# Altium project Holberton.PrjPcb (part 1 of 4)
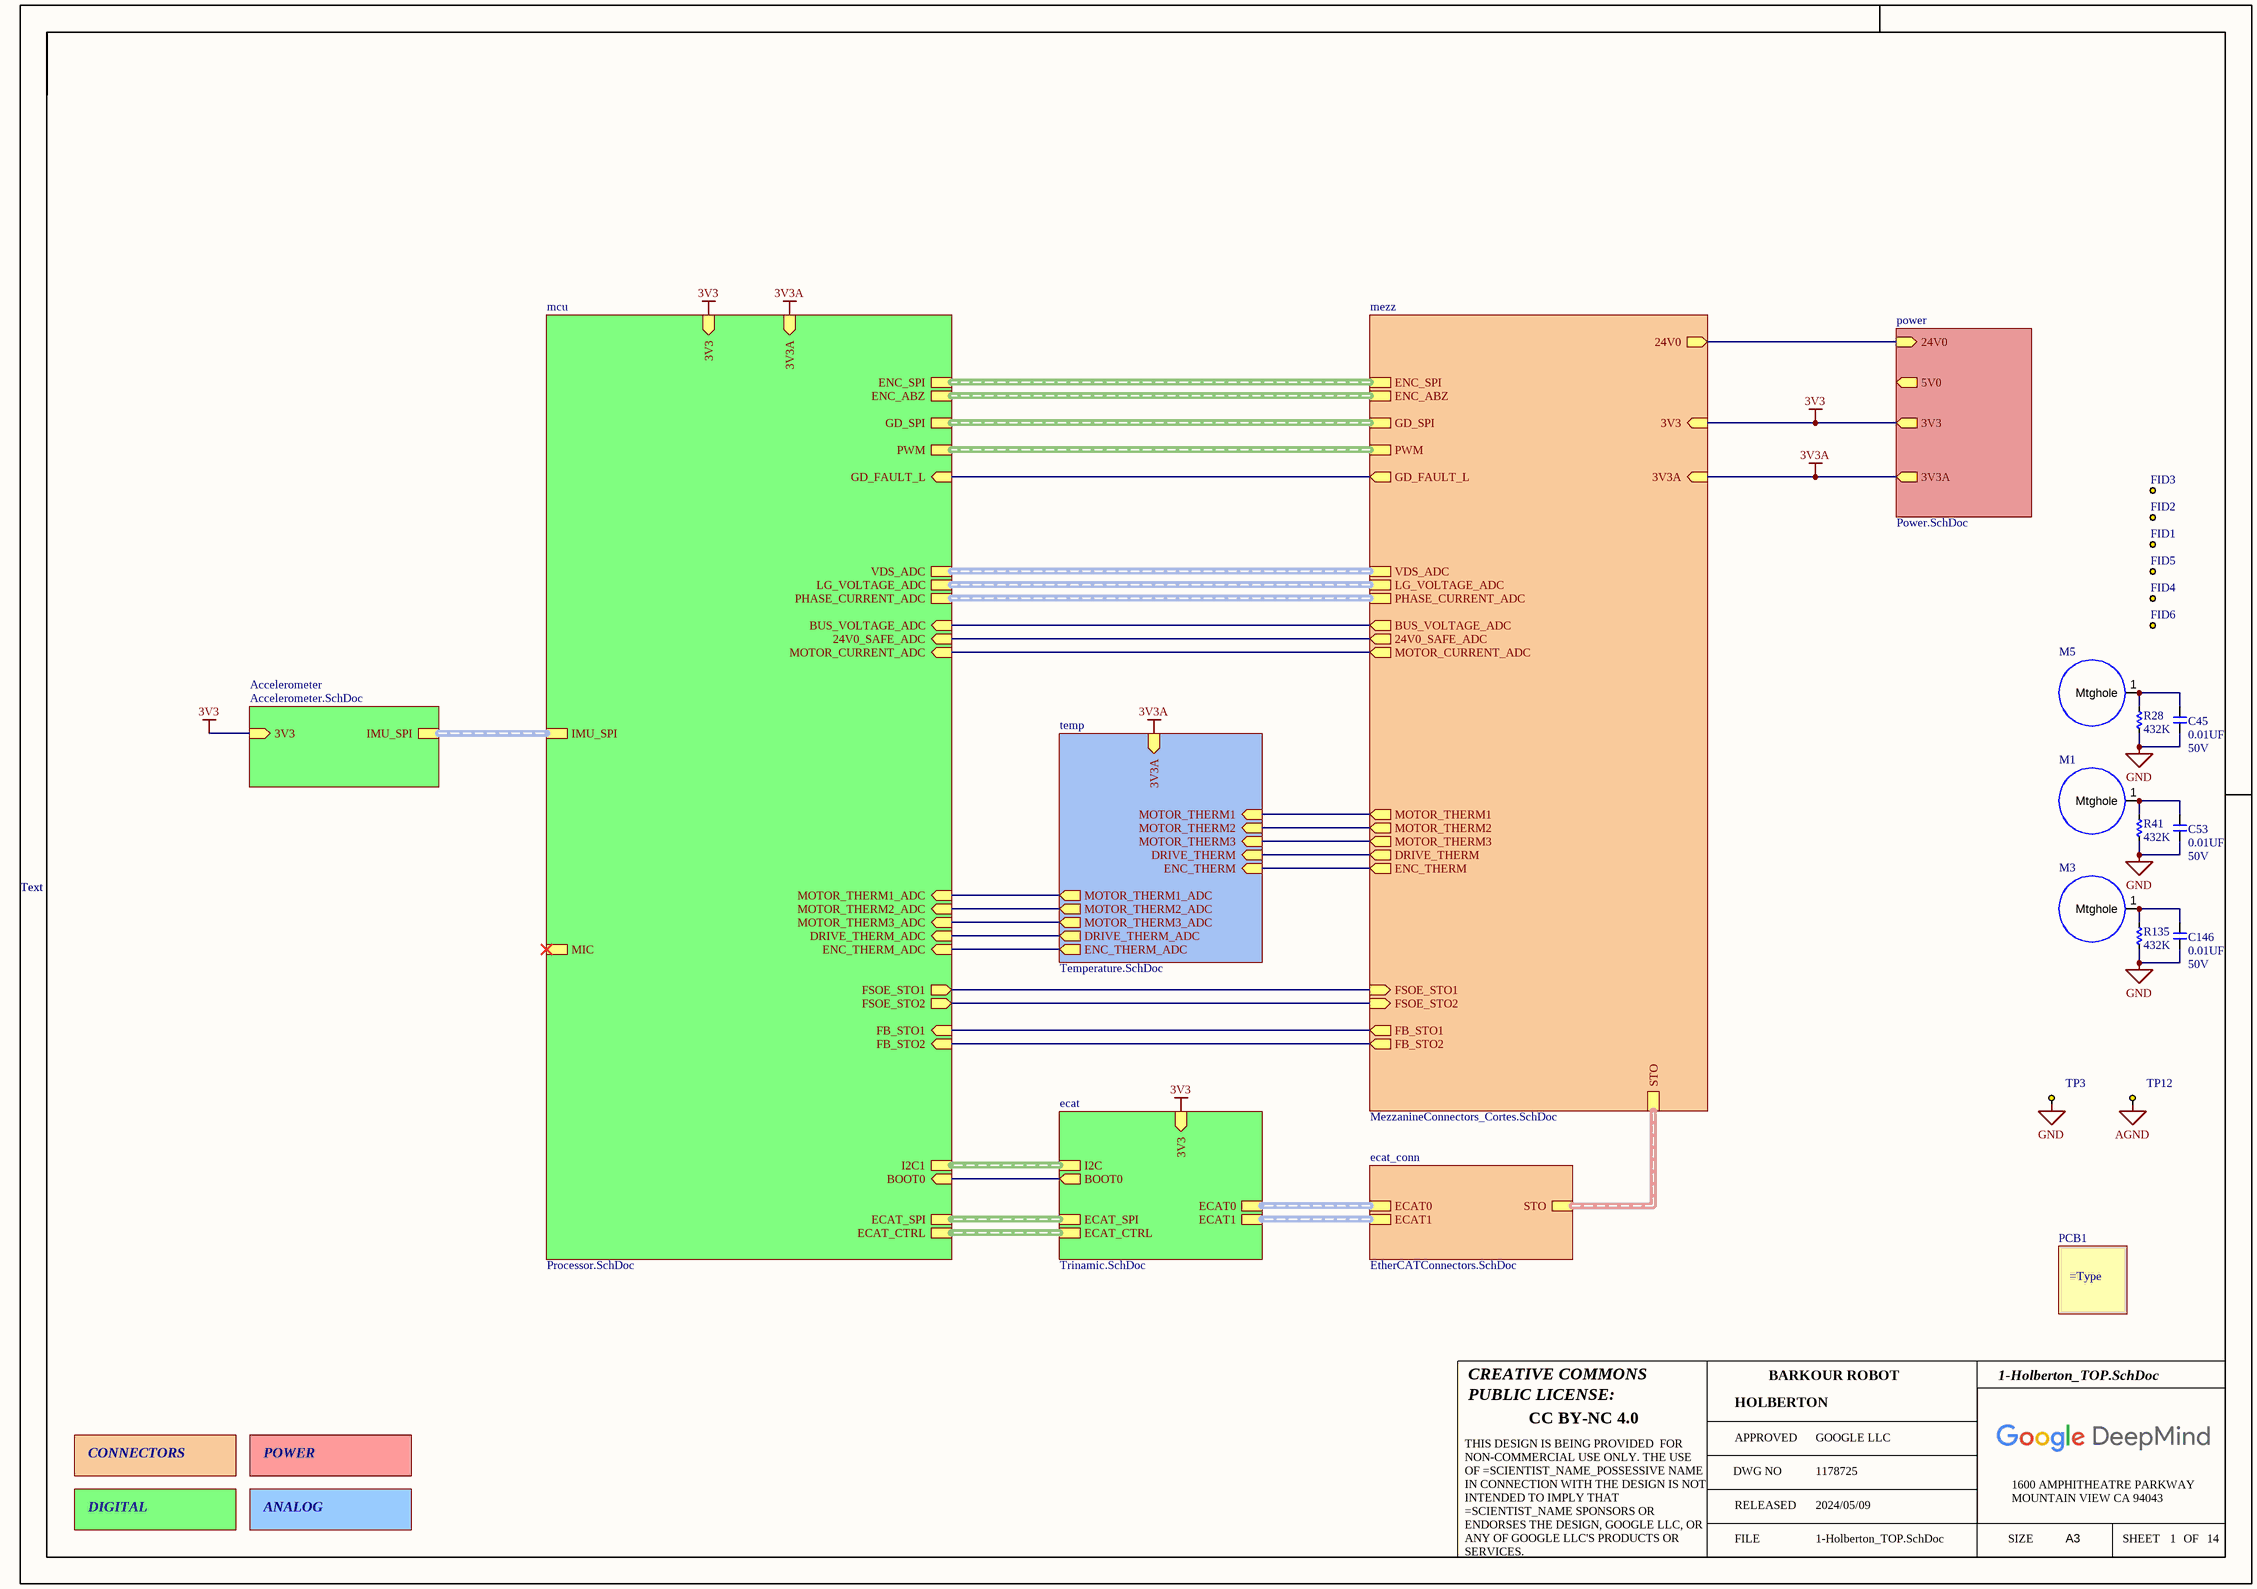
[diagram p0: 1-Holberton_TOP.SchDoc]
GPN_PCBA: 1178725; PROJECT_NAME: HOLBERTON; Scientist_Name: BETTY HOLBERTON; Scientist_Name_Possessive: BETTY HOLBERTON'S
14 sheets, 456 parts. Net scope: hierarchical (ports join the sheet entries above them; power ports are global).
Board file: Holberton.PcbDoc
Sheets:
  1-Holberton_TOP.SchDoc
    mcu = Processor.SchDoc
      proc_support = ProcessorSupport.SchDoc
    Accelerometer = Accelerometer.SchDoc
    ecat = Trinamic.SchDoc
    power = Power.SchDoc
    temp = Temperature.SchDoc
    mezz = MezzanineConnectors_Cortes.SchDoc
      Holberton_Child = 1-Holberton_Child_Top.SchDoc
        feedback = Feedback.SchDoc
        driver = Drive.SchDoc
          PHA = HBridge.SchDoc
          PHB = HBridge.SchDoc
          PHC = HBridge.SchDoc
        sto = STO.SchDoc
    ecat_conn = EtherCATConnectors.SchDoc

## Sheet 1-Holberton_TOP.SchDoc
size 420 x 297 mm; SheetNumber: 1; SheetTotal: 14; PageSetup: Record=PageOptions|CenterHorizontal=True|CenterVertical=True|PrintScale=0.96|XCorrection=1.00|YCorrection=1.00|PrintKind=1|BorderSize=5000000|LeftOffset=0|BottomOffset=0|Orientation=2|PaperLength=4318|PaperWidth=2794|Scale=100|PaperSource=7|PrintQuality=600|MediaType=1|DitherType=10|PaperKind=11" x 17"|PrintScaleMode=1

### Parts
C45  value 0.01UF  Voltage: 50V  [C0402]  (hidden comment: __Template_Cap)
C53  value 0.01UF  Voltage: 50V  [C0402]  (hidden comment: __Template_Cap)
C146  value 0.01UF  Voltage: 50V  [C0402]  (hidden comment: __Template_Cap)
FID1  FIDUCIAL  [FIDUCIAL_1MM]  (value not drawn)  (no BOM)
FID2  FIDUCIAL  [FIDUCIAL_1MM]  (value not drawn)  (no BOM)
FID3  FIDUCIAL  [FIDUCIAL_1MM]  (value not drawn)  (no BOM)
FID4  FIDUCIAL  [FIDUCIAL_1MM]  (value not drawn)  (no BOM)
FID5  FIDUCIAL  [FIDUCIAL_1MM]  (value not drawn)  (no BOM)
FID6  FIDUCIAL  [FIDUCIAL_1MM]  (value not drawn)  (no BOM)
M1  3.7mm hole 5mm pad  [3.7hole5pad]  (value not drawn)  (net tie, no BOM)
M3  3.7mm hole 5mm pad  [3.7hole5pad]  (value not drawn)  (net tie, no BOM)
M5  3.7mm hole 5mm pad  [3.7hole5pad]  (value not drawn)  (net tie, no BOM)
PCB1  (no value)  (mechanical)
R28  432K  [R0402]
R41  432K  [R0402]
R135  432K  [R0402]
TP3  TEST_KEYSTONE5001  [TP_KEYSTONE_5001]  (value not drawn)
TP12  TEST_KEYSTONE5001  [TP_KEYSTONE_5001]  (value not drawn)

### Sub-sheets
Accelerometer = Accelerometer.SchDoc: IMU_SPI (harness SPI_AGM), 3V3 (in)
ecat = Trinamic.SchDoc: ECAT_SPI (harness SPI), ECAT_CTRL (harness Ethercat_Control), 3V3 (in), ECAT0 (harness ECAT), ECAT1 (harness ECAT), I2C (harness I2C), BOOT0 (out)
ecat_conn = EtherCATConnectors.SchDoc: ECAT0 (harness ECAT), STO (harness STO), ECAT1 (harness ECAT)
mcu = Processor.SchDoc: ENC_SPI (harness SPI), IMU_SPI (harness SPI_AGM), MIC (harness PDM), 3V3 (in), 3V3A (in), PWM (harness PWM), GD_SPI (harness SPI), GD_FAULT_L (in), VDS_ADC (harness Phases), LG_VOLTAGE_ADC (harness Phases), PHASE_CURRENT_ADC (harness Phases), MOTOR_CURRENT_ADC (in), 24V0_SAFE_ADC (in), BUS_VOLTAGE_ADC (in), MOTOR_THERM1_ADC (in), MOTOR_THERM2_ADC (in), MOTOR_THERM3_ADC (in), DRIVE_THERM_ADC (in), ECAT_SPI (harness SPI), ECAT_CTRL (harness Ethercat_Control), ENC_THERM_ADC (in), FSOE_STO2 (out), FB_STO1 (in), FB_STO2 (in), FSOE_STO1 (out), I2C1 (harness I2C), BOOT0 (in), ENC_ABZ (harness SPI)
mezz = MezzanineConnectors_Cortes.SchDoc: 24V0 (out), 3V3A (in), MOTOR_THERM1 (out), MOTOR_THERM2 (out), MOTOR_THERM3 (out), VDS_ADC (harness Phases), LG_VOLTAGE_ADC (harness Phases), MOTOR_CURRENT_ADC (out), 24V0_SAFE_ADC (out), PHASE_CURRENT_ADC (harness Phases), BUS_VOLTAGE_ADC (out), DRIVE_THERM (out), PWM (harness PWM), GD_SPI (harness SPI), FSOE_STO2 (in), FB_STO1 (out), FB_STO2 (out), FSOE_STO1 (in), GD_FAULT_L (out), 3V3 (in), ENC_SPI (harness SPI), ENC_THERM (out), STO (harness STO), ENC_ABZ (harness SPI)
power = Power.SchDoc: 24V0 (in), 3V3 (out), 3V3A (out), 5V0 (out)
temp = Temperature.SchDoc: 3V3A (in), MOTOR_THERM1 (in), MOTOR_THERM2 (in), MOTOR_THERM3 (in), DRIVE_THERM (in), MOTOR_THERM1_ADC (out), MOTOR_THERM2_ADC (out), MOTOR_THERM3_ADC (out), DRIVE_THERM_ADC (out), ENC_THERM (in), ENC_THERM_ADC (out)

### Nets
3V3: sheet mcu/3V3, sheet Accelerometer/3V3, sheet ecat/3V3, sheet power/3V3, sheet mezz/3V3
3V3A: sheet mcu/3V3A, sheet power/3V3A, sheet temp/3V3A, sheet mezz/3V3A
AGND: TP12.1
GND: C45.2 C53.2 C146.2 R28.1 R41.1 R135.1 TP3.1
24V0: sheet power/24V0, sheet mezz/24V0
24V0_SAFE_ADC: sheet mcu/24V0_SAFE_ADC, sheet mezz/24V0_SAFE_ADC
BOOT0: sheet mcu/BOOT0, sheet ecat/BOOT0
BUS_VOLTAGE_ADC: sheet mcu/BUS_VOLTAGE_ADC, sheet mezz/BUS_VOLTAGE_ADC
DRIVE_THERM: sheet temp/DRIVE_THERM, sheet mezz/DRIVE_THERM
DRIVE_THERM_ADC: sheet mcu/DRIVE_THERM_ADC, sheet temp/DRIVE_THERM_ADC
ENC_THERM_ADC: sheet mcu/ENC_THERM_ADC, sheet temp/ENC_THERM_ADC
FB_STO1: sheet mcu/FB_STO1, sheet mezz/FB_STO1
FB_STO2: sheet mcu/FB_STO2, sheet mezz/FB_STO2
FSOE_STO1: sheet mcu/FSOE_STO1, sheet mezz/FSOE_STO1
FSOE_STO2: sheet mcu/FSOE_STO2, sheet mezz/FSOE_STO2
GD_FAULT_L: sheet mcu/GD_FAULT_L, sheet mezz/GD_FAULT_L
MOTOR_CURRENT_ADC: sheet mcu/MOTOR_CURRENT_ADC, sheet mezz/MOTOR_CURRENT_ADC
MOTOR_THERM1: sheet temp/MOTOR_THERM1, sheet mezz/MOTOR_THERM1
MOTOR_THERM1_ADC: sheet mcu/MOTOR_THERM1_ADC, sheet temp/MOTOR_THERM1_ADC
MOTOR_THERM2: sheet temp/MOTOR_THERM2, sheet mezz/MOTOR_THERM2
MOTOR_THERM2_ADC: sheet mcu/MOTOR_THERM2_ADC, sheet temp/MOTOR_THERM2_ADC
MOTOR_THERM3: sheet temp/MOTOR_THERM3, sheet mezz/MOTOR_THERM3
MOTOR_THERM3_ADC: sheet mcu/MOTOR_THERM3_ADC, sheet temp/MOTOR_THERM3_ADC
NetC45_1: C45.1 M5.1(Mtghole) R28.2
NetC53_1: C53.1 M1.1(Mtghole) R41.2
NetC90_1: sheet temp/ENC_THERM, sheet mezz/ENC_THERM
NetC146_1: C146.1 M3.1(Mtghole) R135.2

### Buses and harness runs
harness sheet Accelerometer/IMU_SPI = sheet mcu/IMU_SPI
harness sheet ecat/ECAT0 = sheet ecat_conn/ECAT0
harness sheet ecat/ECAT1 = sheet ecat_conn/ECAT1
harness sheet ecat/ECAT_CTRL = sheet mcu/ECAT_CTRL
harness sheet ecat/ECAT_SPI = sheet mcu/ECAT_SPI
harness sheet ecat/I2C = sheet mcu/I2C1
harness sheet ecat_conn/STO = sheet mezz/STO
harness sheet mcu/ENC_ABZ = sheet mezz/ENC_ABZ
harness sheet mcu/ENC_SPI = sheet mezz/ENC_SPI
harness sheet mcu/GD_SPI = sheet mezz/GD_SPI
harness sheet mcu/LG_VOLTAGE_ADC = sheet mezz/LG_VOLTAGE_ADC
harness sheet mcu/PHASE_CURRENT_ADC = sheet mezz/PHASE_CURRENT_ADC
harness sheet mcu/PWM = sheet mezz/PWM
harness sheet mcu/VDS_ADC = sheet mezz/VDS_ADC

### Notes on the sheet
- Text
- CONNECTORS
- POWER
- DIGITAL
- ANALOG
- CREATIVE COMMONS
- PUBLIC LICENSE:
- BARKOUR ROBOT
- CC BY-NC 4.0
- APPROVED
- DWG NO
- GOOGLE LLC
- FILE
- RELEASED
- 2024/05/09
- SIZE
- 1600 AMPHITHEATRE PARKWAY
- MOUNTAIN VIEW CA 94043
- A3
- SHEET
- OF
- THIS DESIGN IS BEING PROVIDED  FOR NON-COMMERCIAL USE ONLY. THE USE OF =SCIENTIST_NAME_POSSESSIVE NAME IN CONNECTION WITH THE DESIGN IS NOT INTENDED TO IMPLY THAT =SCIENTIST_NAME SPONSORS OR ENDORSES THE DESIGN, GOOGLE LLC, OR ANY OF GOOGLE LLC'S PRODUCTS OR SERVICES.

### Library data of the parts
C45 C53 C146 = 625: CAP, CER, X7R, 0.01uF, 50V, 20%, 0402, 0.56mm T; MFG: KEMET; MFG P/N: C0402C103M5RACTU; COMMON: 150-00227-00; Status: Released; Package: 0402; Supplier 1: Digi-Key; ComponentLink1URL: https://www.digikey.com/en/products/detail/kemet/C0402C103M5RAC7867/2196227; Supplier Part Number 1: 399-C0402C103M5RAC7867CT-ND
FID1-FID6 = 93: FIDUCIAL 1MM COPPER CIRCLE 3MM MASK PULLBACK; MFG: _PCB Feature; Status: In Development; Value: FIDUCIAL
M1 M3 M5 = MtgHole: Value: 3.7mm hole 5mm pad
PCB1 = 110: PCB; Status: In Development; MFG P/N: =PCBPN
R28 R41 R135 = 5492: RES, 432K, 1%, 1/16W, 0402; MFG: VISHAY; MFG P/N: CRCW0402432KFKED; Status: Released; Package: 0402; Value: 432K; Supplier 1: Digi-Key; ComponentLink1URL: http://www.vishay.com/docs/28773/crcwce3.pdf; Supplier Part Number 1: 541-432KLCT-ND
TP3 TP12 = TEST_KEYSTONE5001: PC TEST POINT TH RING; MFG: Keystone Electronics; MFG P/N: 5001; Value: 5001; Supplier 1: Digi-Key; Supplier Part Number 1: 5001K-ND; ComponentLink1URL: http://www.keyelco.com/product-pdf.cfm?p=1310; Status: In Development

## Sheet Processor.SchDoc
size 420 x 297 mm; SheetNumber: 5; SheetTotal: 14; PageSetup: Record=PageOptions|CenterHorizontal=True|CenterVertical=True|PrintScale=0.96|XCorrection=1.00|YCorrection=1.00|PrintKind=1|BorderSize=5000000|LeftOffset=0|BottomOffset=0|Orientation=2|PaperLength=4318|PaperWidth=2794|Scale=100|PaperSource=7|PrintQuality=600|MediaType=1|DitherType=10|PaperKind=11" x 17"|PrintScaleMode=1
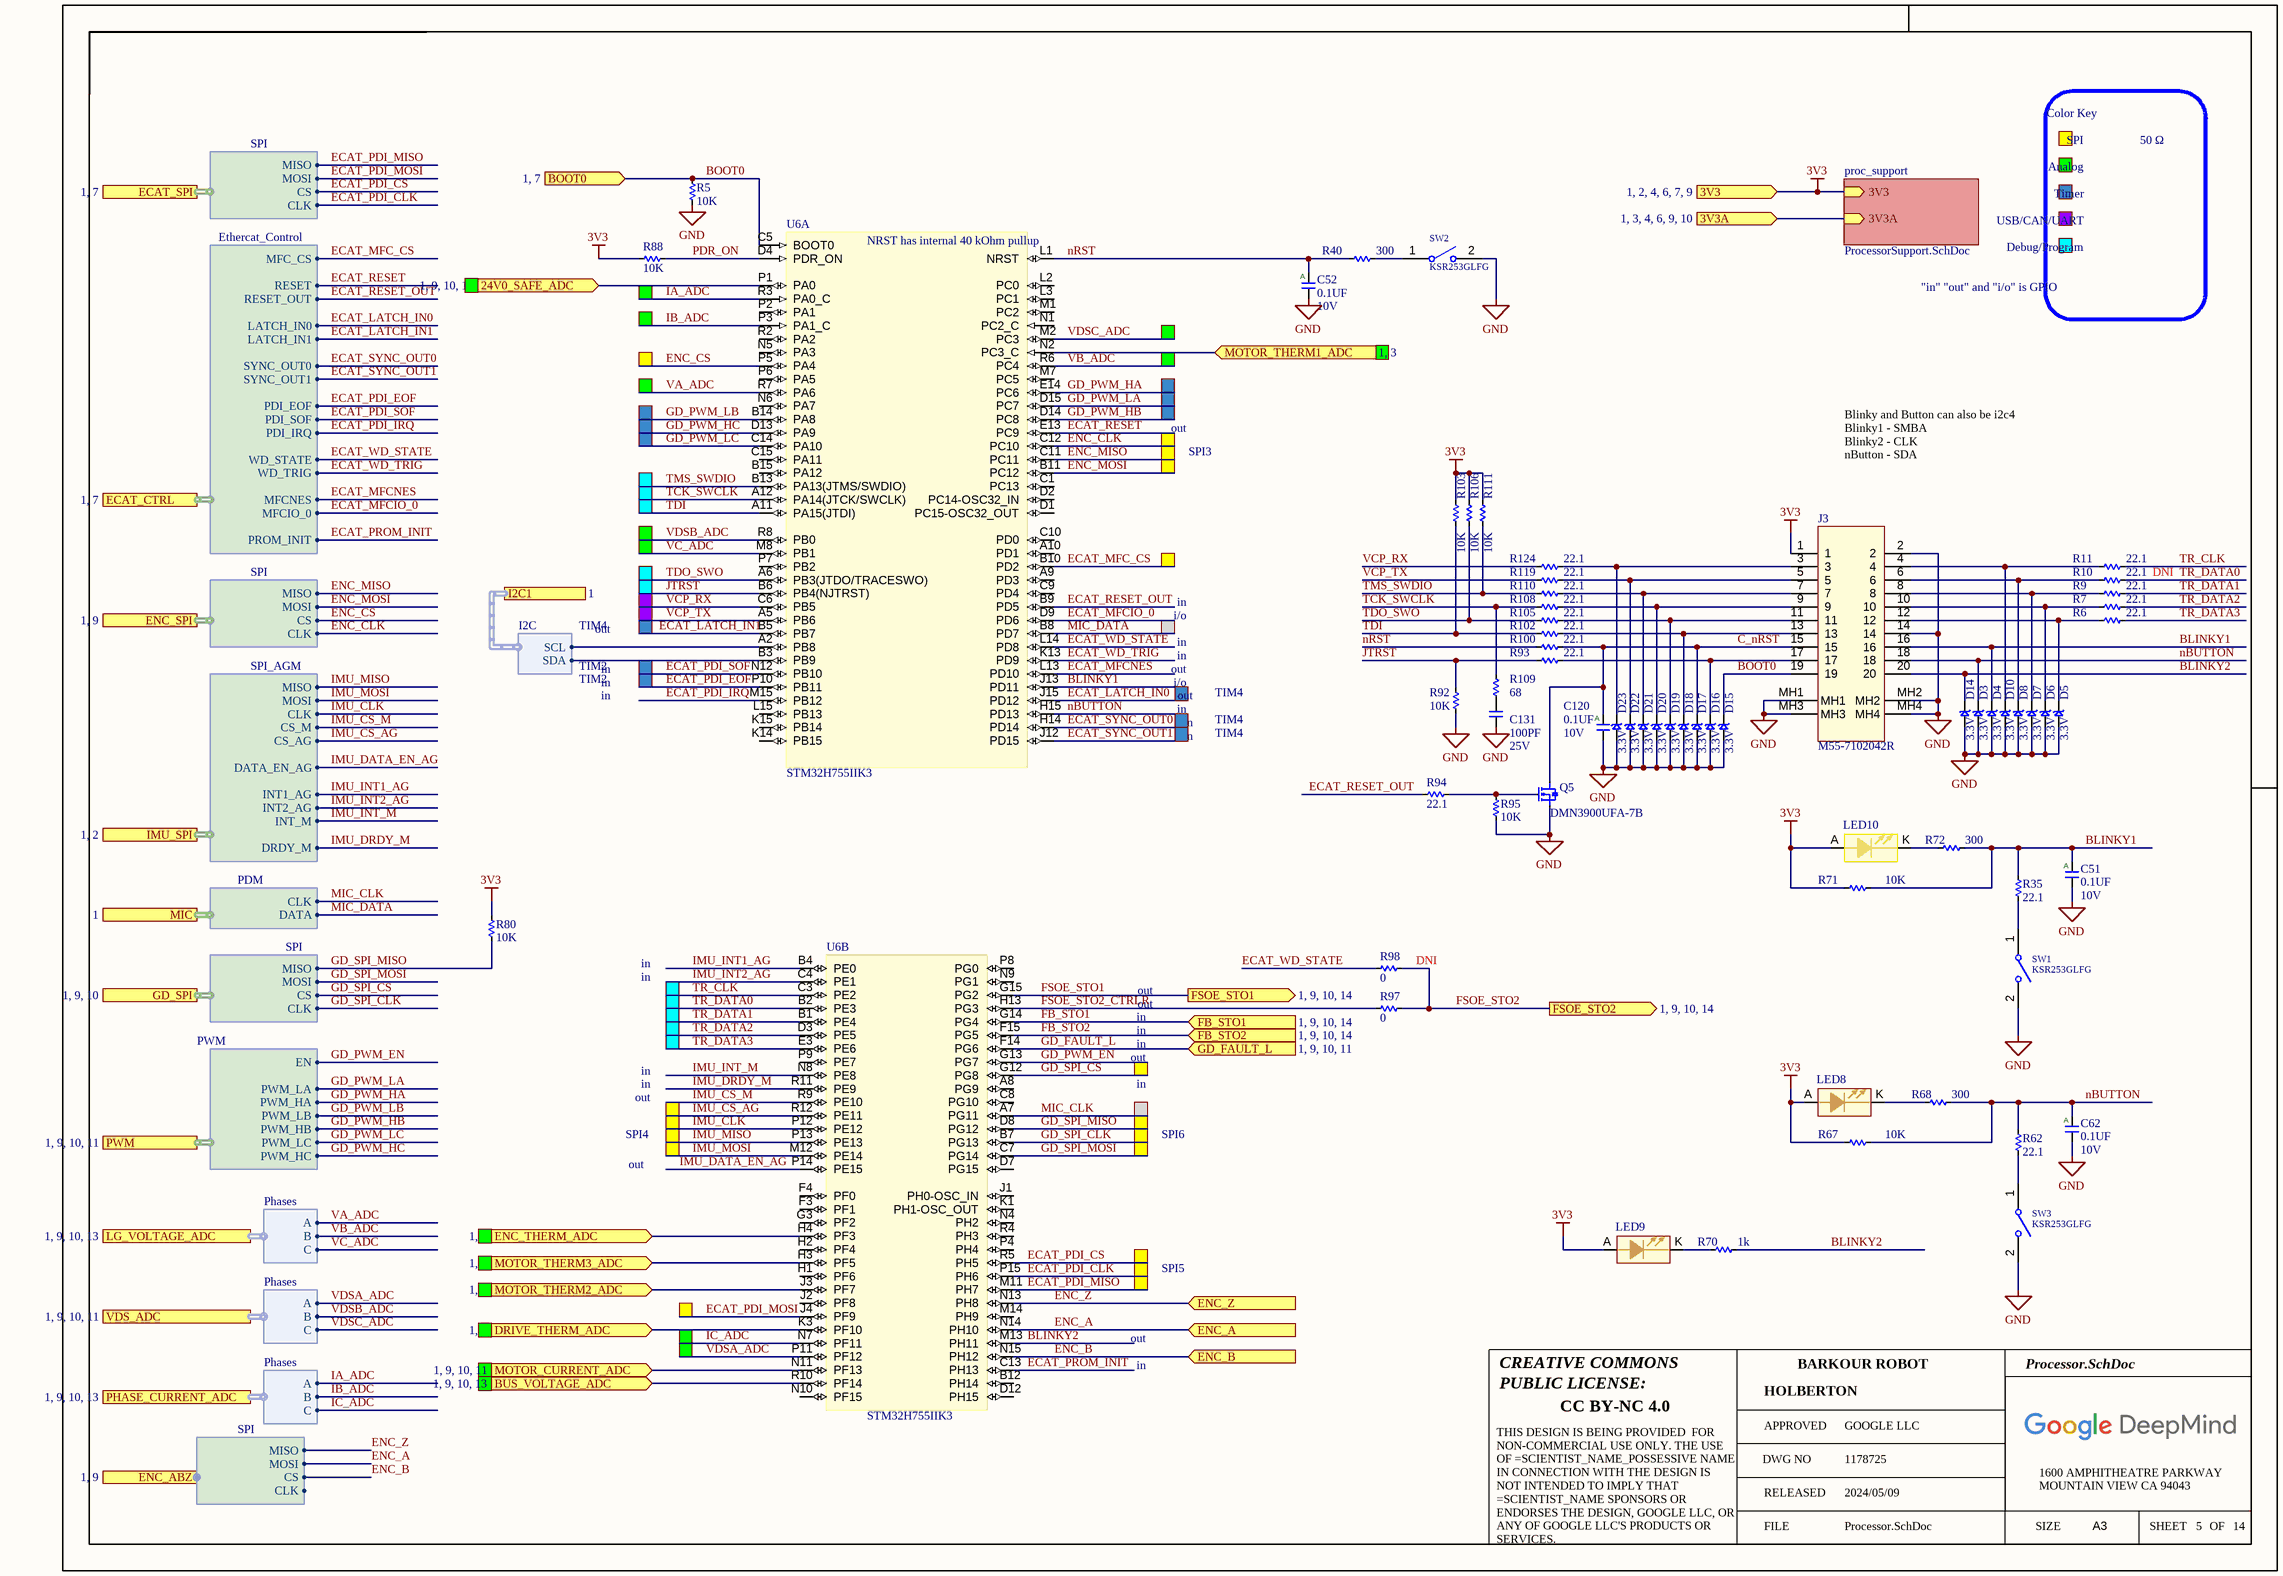
[diagram p1: Processor.SchDoc]

### Parts
C51  value 0.1UF  Voltage: 10V  [C0201]  (hidden comment: __Template_Cap_Auto)
C52  value 0.1UF  Voltage: 10V  [C0201]  (hidden comment: __Template_Cap_Auto)
C62  value 0.1UF  Voltage: 10V  [C0201]  (hidden comment: __Template_Cap_Auto)
C120  value 0.1UF  Voltage: 10V  [C0201]  (hidden comment: __Template_Cap_Auto)
C131  value 100PF  Voltage: 25V  [C0201]  (hidden comment: __Template_Cap)
D3  3.3V  [SOD1060X40]
D4  3.3V  [SOD1060X40]
D5  3.3V  [SOD1060X40]
D6  3.3V  [SOD1060X40]
D7  3.3V  [SOD1060X40]
D8  3.3V  [SOD1060X40]
D10  3.3V  [SOD1060X40]
D14  3.3V  [SOD1060X40]
D15  3.3V  [SOD1060X40]
D16  3.3V  [SOD1060X40]
D17  3.3V  [SOD1060X40]
D18  3.3V  [SOD1060X40]
D19  3.3V  [SOD1060X40]
D20  3.3V  [SOD1060X40]
D21  3.3V  [SOD1060X40]
D22  3.3V  [SOD1060X40]
D23  3.3V  [SOD1060X40]
J3  M55-7102042R  [CON_M55-7102042R]
LED8  __Template_LED_ORANGE_AK  [LED_APG0603SYC-TT]  (value not drawn)
LED9  __Template_LED_ORANGE_AK  [LED_APG0603SYC-TT]  (value not drawn)
LED10  __Template_LED_YELLOW_AK  [LED_APG0603SYC-TT]  (value not drawn)
Q5  MFG P/N: DMN3900UFA-7B  [3XDFN]  (hidden comment: NFET_DMN3900UFA)
R5  value 10K  [R0201]  (hidden comment: __Template_Resistor)
R6  value 22.1  [R0201]  (hidden comment: __Template_Resistor)
R7  value 22.1  [R0201]  (hidden comment: __Template_Resistor)
R9  value 22.1  [R0201]  (hidden comment: __Template_Resistor)
R10  value 22.1  [R0201]  (hidden comment: __Template_Resistor)
R11  value 22.1  [R0201]  (hidden comment: __Template_Resistor)
R35  value 22.1  [R0201]  (hidden comment: __Template_Resistor)
R40  value 300  [R0201]  (hidden comment: __Template_Resistor)
R62  value 22.1  [R0201]  (hidden comment: __Template_Resistor)
R67  value 10K  [R0201]  (hidden comment: __Template_Resistor)
R68  value 300  [R0201]  (hidden comment: __Template_Resistor)
R70  value 1k  [R0201]  (hidden comment: __Template_Resistor)
R71  value 10K  [R0201]  (hidden comment: __Template_Resistor)
R72  value 300  [R0201]  (hidden comment: __Template_Resistor)
R80  value 10K  [R0201]  (hidden comment: __Template_Resistor)
R88  value 10K  [R0201]  (hidden comment: __Template_Resistor)
R92  value 10K  [R0201]  (hidden comment: __Template_Resistor)
R93  value 22.1  [R0201]  (hidden comment: __Template_Resistor)
R94  value 22.1  [R0201]  (hidden comment: __Template_Resistor)
R95  value 10K  [R0201]  (hidden comment: __Template_Resistor)
R97  0  [R0402]
R98  0  [R0402]
R100  value 22.1  [R0201]  (hidden comment: __Template_Resistor)
R102  value 22.1  [R0201]  (hidden comment: __Template_Resistor)
R103  value 10K  [R0201]  (hidden comment: __Template_Resistor)
R105  value 22.1  [R0201]  (hidden comment: __Template_Resistor)
R106  value 10K  [R0201]  (hidden comment: __Template_Resistor)
R108  value 22.1  [R0201]  (hidden comment: __Template_Resistor)
R109  value 68  [R0201]  (hidden comment: __Template_Resistor)
R110  value 22.1  [R0201]  (hidden comment: __Template_Resistor)
R111  value 10K  [R0201]  (hidden comment: __Template_Resistor)
R119  value 22.1  [R0201]  (hidden comment: __Template_Resistor)
R124  value 22.1  [R0201]  (hidden comment: __Template_Resistor)
SW1  KSR253GLFG  [SW_KSR253GLFG]
SW2  KSR253GLFG  [SW_KSR253GLFG]
SW3  KSR253GLFG  [SW_KSR253GLFG]
U6  MFG P/N: STM32H755IIK3  [BGS201C65P15X15_1000X1000X60]  (hidden comment: MCU_STM32H755IIK3)  (parts A,B of 3)

### Sub-sheets
proc_support = ProcessorSupport.SchDoc: 3V3 (in), 3V3A (in)

### Ports
3V3 (in, see 1, 2, 4, 6, 7, 9), 3V3A (in, see 1, 3, 4, 6, 9, 10), 24V0_SAFE_ADC (in, see 1, 9, 10, 14), BOOT0 (in, see 1, 7), BUS_VOLTAGE_ADC (in, see 1, 9, 10, 13), DRIVE_THERM_ADC (in, see 1, 3), ECAT_CTRL (harness Ethercat_Control, see 1, 7), ECAT_SPI (harness SPI, see 1, 7), ENC_A (in), ENC_ABZ (harness SPI, see 1, 9), ENC_B (in), ENC_SPI (harness SPI, see 1, 9), ENC_THERM_ADC (in, see 1, 3), ENC_Z (in), FB_STO1 (in, see 1, 9, 10, 14), FB_STO2 (in, see 1, 9, 10, 14), FSOE_STO1 (out, see 1, 9, 10, 14), FSOE_STO2 (out, see 1, 9, 10, 14), GD_FAULT_L (in, see 1, 9, 10, 11), GD_SPI (harness SPI, see 1, 9, 10), I2C1 (harness I2C, see 1), IMU_SPI (harness SPI_AGM, see 1, 2), LG_VOLTAGE_ADC (harness Phases, see 1, 9, 10, 13), MIC (harness PDM, see 1), MOTOR_CURRENT_ADC (in, see 1, 9, 10, 11), MOTOR_THERM1_ADC (in, see 1, 3), MOTOR_THERM2_ADC (in, see 1, 3), MOTOR_THERM3_ADC (in, see 1, 3), PHASE_CURRENT_ADC (harness Phases, see 1, 9, 10, 13), PWM (harness PWM, see 1, 9, 10, 11), VDS_ADC (harness Phases, see 1, 9, 10, 11)

### Harnesses
SPI: CLK, CS, MOSI, MISO
PDM: DATA, CLK
SPI: MISO, MOSI, CS, CLK
Ethercat_Control: MFC_CS, LATCH_IN0, LATCH_IN1, RESET_OUT, SYNC_OUT0, SYNC_OUT1, PDI_EOF, PDI_SOF, PDI_IRQ, RESET, WD_STATE, WD_TRIG, MFCNES, MFCIO_0, PROM_INIT
SPI_AGM: CLK, MOSI, CS_AG, DATA_EN_AG, CS_M, MISO, INT1_AG, INT2_AG, INT_M, DRDY_M
PWM: EN, PWM_LA, PWM_HA, PWM_LB, PWM_HB, PWM_LC, PWM_HC
Phases: A, B, C
I2C: SDA, SCL

### Nets
3V3: J3.1 LED8.A LED9.A LED10.A R67.2 R71.2 R80.2 R88.2 R103.2 R106.2 R111.2 ; port 3V3, sheet proc_support/3V3
3V3A: port 3V3A, sheet proc_support/3V3A
GND: C51.2 C52.2 C62.2 C120.2 C131.2 D3.A D4.A D5.A D6.A D7.A D8.A D10.A D14.A D15.A D16.A D17.A D18.A D19.A D20.A D21.A D22.A D23.A J3.2 J3.14 J3.MH1 J3.MH2 J3.MH3 J3.MH4 Q5.2(S) R5.1 R92.1 R95.1 SW1.2 SW2.2 SW3.2
24V0_SAFE_ADC: U6.P1(PA0) ; port 24V0_SAFE_ADC
BLINKY1: C51.1 D4.K J3.16 R35.1 R71.1 R72.2 U6.J13(PD11)
BLINKY2: D14.K J3.20 R70.2 U6.M13(PH11)
BOOT0: D15.K J3.19 R5.2 U6.C5(BOOT0) ; port BOOT0
BUS_VOLTAGE_ADC: U6.R10(PF14) ; port BUS_VOLTAGE_ADC
C_nRST: C120.1 D17.K J3.15 Q5.3(D) R100.2
DRIVE_THERM_ADC: U6.K3(PF10) ; port DRIVE_THERM_ADC
ECAT_LATCH_IN0: U6.J15(PD12) ; port ECAT_CTRL.LATCH_IN0
ECAT_LATCH_IN1: U6.B5(PB7) ; port ECAT_CTRL.LATCH_IN1
ECAT_MFC_CS: U6.B10(PD2) ; port ECAT_CTRL.MFC_CS
ECAT_MFCIO_0: U6.D9(PD6) ; port ECAT_CTRL.MFCIO_0
ECAT_MFCNES: U6.L13(PD10) ; port ECAT_CTRL.MFCNES
ECAT_PDI_CLK: U6.P15(PH6) ; port ECAT_SPI.CLK
ECAT_PDI_CS: U6.R5(PH5) ; port ECAT_SPI.CS
ECAT_PDI_EOF: U6.P10(PB11) ; port ECAT_CTRL.PDI_EOF
ECAT_PDI_IRQ: U6.M15(PB12) ; port ECAT_CTRL.PDI_IRQ
ECAT_PDI_MISO: U6.M11(PH7) ; port ECAT_SPI.MISO
ECAT_PDI_MOSI: U6.J4(PF9) ; port ECAT_SPI.MOSI
ECAT_PDI_SOF: U6.N12(PB10) ; port ECAT_CTRL.PDI_SOF
ECAT_PROM_INIT: U6.C13(PH13) ; port ECAT_CTRL.PROM_INIT
ECAT_RESET: U6.E13(PC9) ; port ECAT_CTRL.RESET
ECAT_RESET_OUT: R94.1 U6.B9(PD5) ; port ECAT_CTRL.RESET_OUT
ECAT_SYNC_OUT0: U6.H14(PD14) ; port ECAT_CTRL.SYNC_OUT0
ECAT_SYNC_OUT1: U6.J12(PD15) ; port ECAT_CTRL.SYNC_OUT1
ECAT_WD_STATE: R98.2 U6.L14(PD8) ; port ECAT_CTRL.WD_STATE
ECAT_WD_TRIG: U6.K13(PD9) ; port ECAT_CTRL.WD_TRIG
ENC_A: U6.N14(PH10) ; port ENC_A, port ENC_ABZ.MOSI
ENC_B: U6.N15(PH12) ; port ENC_B, port ENC_ABZ.CS
ENC_CLK: U6.C12(PC10) ; port ENC_SPI.CLK
ENC_CS: U6.P5(PA4) ; port ENC_SPI.CS
ENC_MISO: U6.C11(PC11) ; port ENC_SPI.MISO
ENC_MOSI: U6.B11(PC12) ; port ENC_SPI.MOSI
ENC_THERM_ADC: U6.H4(PF3) ; port ENC_THERM_ADC
ENC_Z: U6.N13(PH8) ; port ENC_Z, port ENC_ABZ.MISO
FB_STO1: U6.G14(PG4) ; port FB_STO1
FB_STO2: U6.F15(PG5) ; port FB_STO2
FSOE_STO1: U6.G15(PG2) ; port FSOE_STO1
FSOE_STO2: R97.1 R98.1 ; port FSOE_STO2
FSOE_STO2_CTRLR: R97.2 U6.H13(PG3)
GD_FAULT_L: U6.F14(PG6) ; port GD_FAULT_L
GD_PWM_EN: U6.G13(PG7) ; port PWM.EN
GD_PWM_HA: U6.E14(PC6) ; port PWM.PWM_HA
GD_PWM_HB: U6.D14(PC8) ; port PWM.PWM_HB
GD_PWM_HC: U6.D13(PA9) ; port PWM.PWM_HC
GD_PWM_LA: U6.D15(PC7) ; port PWM.PWM_LA
GD_PWM_LB: U6.B14(PA8) ; port PWM.PWM_LB
GD_PWM_LC: U6.C14(PA10) ; port PWM.PWM_LC
GD_SPI_CLK: U6.B7(PG13) ; port GD_SPI.CLK  [project net GD_CLK]
GD_SPI_CS: U6.G12(PG8) ; port GD_SPI.CS  [project net GD_CS]
GD_SPI_MISO: R80.1 U6.D8(PG12) ; port GD_SPI.MISO  [project net GD_MISO]
GD_SPI_MOSI: U6.C7(PG14) ; port GD_SPI.MOSI  [project net GD_MOSI]
IA_ADC: U6.R3(PA0_C) ; port PHASE_CURRENT_ADC.A
IB_ADC: U6.P3(PA1_C) ; port PHASE_CURRENT_ADC.B
IC_ADC: U6.N7(PF11) ; port PHASE_CURRENT_ADC.C
IMU_CLK: U6.P12(PE12) ; port IMU_SPI.CLK  [project net AGM_CLK]
IMU_CS_AG: U6.R12(PE11) ; port IMU_SPI.CS_AG  [project net AGM_CS_AG]
IMU_CS_M: U6.R9(PE10) ; port IMU_SPI.CS_M
IMU_DATA_EN_AG: U6.P14(PE15) ; port IMU_SPI.DATA_EN_AG  [project net AGM_DATA_EN_AG]
IMU_DRDY_M: U6.R11(PE9) ; port IMU_SPI.DRDY_M  [project net AGM_DRDY_M]
IMU_INT1_AG: U6.B4(PE0) ; port IMU_SPI.INT1_AG  [project net AGM_INT1_AG]
IMU_INT2_AG: U6.C4(PE1) ; port IMU_SPI.INT2_AG  [project net AGM_INT2_AG]
IMU_INT_M: U6.N8(PE8) ; port IMU_SPI.INT_M  [project net AGM_INT_M]
IMU_MISO: U6.P13(PE13) ; port IMU_SPI.MISO  [project net AGM_MISO]
IMU_MOSI: U6.M12(PE14) ; port IMU_SPI.MOSI  [project net AGM_MOSI]
JTRST: R92.2 R93.1 U6.B6(PB4(NJTRST))
MFCIO_SCL: U6.A2(PB8) ; port I2C1.SCL
MFCIO_SDA: U6.B3(PB9) ; port I2C1.SDA
MIC_CLK: U6.A7(PG11) ; port MIC.CLK
MIC_DATA: U6.B8(PD7) ; port MIC.DATA
MOTOR_CURRENT_ADC: U6.N11(PF13) ; port MOTOR_CURRENT_ADC
MOTOR_THERM1_ADC: U6.N2(PC3_C) ; port MOTOR_THERM1_ADC
MOTOR_THERM2_ADC: U6.J3(PF7) ; port MOTOR_THERM2_ADC
MOTOR_THERM3_ADC: U6.H3(PF5) ; port MOTOR_THERM3_ADC
nBUTTON: C62.1 D3.K J3.18 R62.1 R67.1 R68.1 U6.H15(PD13)
nRST: C52.1 R40.1 R100.1 U6.L1(NRST)
PDR_ON: R88.1 U6.D4(PDR_ON)
TCK_SWCLK: R108.1 R109.2 U6.A12(PA14(JTCK/SWCLK))
TDI: R102.1 R103.1 U6.A11(PA15(JTDI))
TDO_SWO: R105.1 R106.1 U6.A6(PB3(JTDO/TRACESWO))
TMS_SWDIO: R110.1 R111.1 U6.B13(PA13(JTMS/SWDIO))
TR_CLK: R11.2 U6.C3(PE2)
TR_DATA0: R10.2 U6.B2(PE3)
TR_DATA1: R9.2 U6.B1(PE4)
TR_DATA2: R7.2 U6.D3(PE5)
TR_DATA3: R6.2 U6.E3(PE6)
VA_ADC: U6.R7(PA6) ; port LG_VOLTAGE_ADC.A  [project net PHASE_V_ADC_A]
VB_ADC: U6.R6(PC4) ; port LG_VOLTAGE_ADC.B  [project net PHASE_V_ADC_B]
VC_ADC: U6.M8(PB1) ; port LG_VOLTAGE_ADC.C  [project net PHASE_V_ADC_C]
VCP_RX: R124.1 U6.C6(PB5)
VCP_TX: R119.1 U6.A5(PB6)
VDSA_ADC: U6.P11(PF12) ; port VDS_ADC.A  [project net VDS_C_ADC]
VDSB_ADC: U6.R8(PB0) ; port VDS_ADC.B  [project net VDS_B_ADC]
VDSC_ADC: U6.M2(PC3) ; port VDS_ADC.C  [project net VDS_A_ADC]
NetC131_1: C131.1 R109.1
NetD5_K: D5.K J3.12 R6.1
NetD6_K: D6.K J3.10 R7.1
NetD7_K: D7.K J3.8 R9.1
NetD8_K: D8.K J3.6 R10.1
NetD10_K: D10.K J3.4 R11.1
NetD16_K: D16.K J3.17 R93.2
NetD18_K: D18.K J3.13 R102.2
NetD19_K: D19.K J3.11 R105.2
NetD20_K: D20.K J3.9 R108.2
NetD21_K: D21.K J3.7 R110.2
NetD22_K: D22.K J3.5 R119.2
NetD23_K: D23.K J3.3 R124.2
NetLED8_K: LED8.K R68.2
NetLED9_K: LED9.K R70.1
NetLED10_K: LED10.K R72.1
NetQ5_1: Q5.1(G) R94.2 R95.2
NetR35_2: R35.2 SW1.1
NetR40_2: R40.2 SW2.1
NetR62_2: R62.2 SW3.1

Not connected (* = marked no-connect by the designer): U6 A8(PG9) A9(PD3) A10(PD1) B12(PH14) B15(PA12) C1(PC13) C8(PG10) C9(PD4) C10(PD0) C15(PA11) D1(PC15-OSC32_OUT) D2(PC14-OSC32_IN) D7(PG15) D12(PH15) F3(PF1) F4(PF0) G3(PF2) H1(PF6) H2(PF4) J1(PH0-OSC_IN) J2(PF8) K1(PH1-OSC_OUT) K14(PB15) K15(PB14) L2(PC0) L3(PC1) L15(PB13) M1(PC2) M7(PC5) M14(PH9) N1(PC2_C) N4(PH2) N5(PA3) N6(PA7) N9(PG1) N10(PF15) P2(PA1) P4(PH4) P6(PA5) P7(PB2) P8(PG0) P9(PE7) R2(PA2) R4(PH3)

### Notes on the sheet
- SPI
- Color Key
- 50 Ω
- Analog
- Timer
- (near U6) NRST has internal 40 kOhm pullup
- USB/CAN/UART
- Debug/Program
- "in" "out" and "i/o" is GPIO
- out
- SPI3
- Blinky and Button can also be i2c4
  Blinky1 - SMBA
  Blinky2 - CLK
  nButton - SDA
- in
- TIM4
- i/o
- TIM2
- SPI4
- SPI6
- SPI5
- CREATIVE COMMONS
- PUBLIC LICENSE:
- BARKOUR ROBOT
- CC BY-NC 4.0
- APPROVED
- DWG NO
- GOOGLE LLC
- FILE
- RELEASED
- 2024/05/09
- SIZE
- 1600 AMPHITHEATRE PARKWAY
- MOUNTAIN VIEW CA 94043
- A3
- SHEET
- OF
- THIS DESIGN IS BEING PROVIDED  FOR NON-COMMERCIAL USE ONLY. THE USE OF =SCIENTIST_NAME_POSSESSIVE NAME IN CONNECTION WITH THE DESIGN IS NOT INTENDED TO IMPLY THAT =SCIENTIST_NAME SPONSORS OR ENDORSES THE DESIGN, GOOGLE LLC, OR ANY OF GOOGLE LLC'S PRODUCTS OR SERVICES.
- (in symbol 934) A

### Library data of the parts
C51 C52 C62 C120 = 934: CAP, CER, X6S, 0.1uF, 10V, 10%, 0201, AUTOGRADE; MFG: MURATA; MFG P/N: GRT033C81A104KE01D; COMMON: 150-01178-00; Status: Released; Package: 0201; Supplier 1: Digi-key; ComponentLink1URL: https://search.murata.co.jp/Ceramy/image/img/A01X/G101/ENG/GRT033C81A104KE01-01.pdf; Supplier Part Number 1: 490-12232-1-ND
C131 = 767: CAP, CER, X7R, 100pF, 25V, 10%, 0201, 0.33mm T; MFG: MURATA; MFG P/N: GRM033R71E101KA01D; COMMON: 150-00022-00; Status: Released; Package: 0201; Supplier 1: Digi-Key; ComponentLink1URL: https://www.digikey.com/en/products/detail/murata-electronics/GRM033R71E101KA01D/702438; Supplier Part Number 1: 490-3172-1-ND
D3-D8 D10 D14-D23 = 192: TVS, DIODE, UNIDIR, 3.3VRWM, 4.8VBR, 7.8VCL, SOD-923; MFG: ON Semiconductor; MFG P/N: ESD9R3.3ST5G; Value: ESD9R3.3ST5G; Status: Released; Package: SOD-923; Supplier 1: Digi-Key; ComponentLink1URL: http://www.onsemi.com/pub/Collateral/ESD9R3.3S-D.PDF; Supplier Part Number 1: ESD9R3.3ST5GOSCT-ND
J3 = 1204: CONN HEADER SMD R/A 20POS 1.27MM; MFG: Harwin Inc.; Status: Released; MFG P/N: M55-7102042R; Supplier 1: Digi-Key; ComponentLink1URL: https://www.digikey.com/en/products/detail/harwin-inc/M55-7102042R/8537613?s=N4IgTCBcDaILIFYEFoDsBGADGTAWMASiALoC%2BQA; Supplier Part Number 1: 952-3893-1-ND; Value: M55-7102042R
LED8 LED9 = 308: LED, ORANGE, 611NM, 10mA, CLEAR, 0201; MFG: Kingbright; MFG P/N: APG0603SEC-TT; Value: APG0603SEC-TT; Status: Released; Package: 0201; Supplier 1: Digi-Key; ComponentLink1URL: http://www.kingbrightusa.com/images/catalog/SPEC/APG0603SEC-TT.pdf; Supplier Part Number 1: 754-2027-1-ND
LED10 = 307: LED, YELLOW, 591NM, 10mA, CLEAR, 0201; MFG: Kingbright; MFG P/N: APG0603SYC-TT; Value: APG0603SYC-TT; Status: Released; Package: 0201; Supplier 1: Digi-Key; ComponentLink1URL: http://www.kingbrightusa.com/images/catalog/SPEC/APG0603SYC-TT.pdf; Supplier Part Number 1: 754-2025-1-ND
Q5 = 24: MOSFET, N-CH, 30V, 0.55A, DMN3900; MFG: Diodes Incorporated; COMMON: 480-00750-00; Value: DMN3900UFA-7B; Status: Released; Package: 3-XFDFN; ComponentLink1URL: http://www.diodes.com/datasheets/DMN3900UFA.pdf; Supplier 1: Digi-Key; Supplier Part Number 1: DMN3900UFA-7BCT-ND
R5 R67 R71 R80 R88 R92 R95 R103 R106 R111 = 6783: RES, 10K, 1%, 1/20W, 0201, AUTOGRADE; MFG: PANASONIC; MFG P/N: ERJ1GNF1002C; COMMON: 470-00033-00; Status: Released; Package: 0201; Supplier 1: Digi-Key; ComponentLink1URL: https://industrial.panasonic.com/cdbs/www-data/pdf/RDA0000/AOA0000C304.pdf; Supplier Part Number 1: P122414CT-ND
R6 R7 R9-R11 R35 R62 R93 R94 R100 R102 R105 R108 R110 R119 R124 = 10012: RES, 22.1, 1%, 1/20W, 0201, AUTOGRADE; MFG: Panasonic Electronic Components; MFG P/N: ERJ-1GNF22R1C; Status: Released; Package: 0201; Supplier 1: Digi-Key; ComponentLink1URL: https://industrial.panasonic.com/cdbs/www-data/pdf/RDA0000/AOA0000C304.pdf; Supplier Part Number 1: P122844CT-ND
  R10: DNI: DNI
R40 R72 = 10012: RES, 300, 1%, 1/20W, 0201, AUTOGRADE; MFG: Panasonic Electronic Components; MFG P/N: ERJ-1GNF3000C; Status: Released; Package: 0201; Supplier 1: Digi-Key; ComponentLink1URL: https://www.digikey.com/en/products/detail/panasonic-electronic-components/ERJ-1GNF3000C/2036050; Supplier Part Number 1: P122911CT-ND
R68 = 10010: RES, 300, 1%, 1/20W, 0201, AUTOGRADE; MFG: Panasonic Electronic Components; MFG P/N: ERJ-1GNF3000C; Status: Released; Package: 0201; Supplier 1: Digi-Key; ComponentLink1URL: https://www.digikey.com/en/products/detail/panasonic-electronic-components/ERJ-1GNF3000C/2036050; Supplier Part Number 1: P122911CT-ND
R70 = 10010: RES, 1K, 1%, 1/20W, 0201, AUTOGRADE; MFG: Bourns Inc.; MFG P/N: CR0201AFW-1001GLF; Status: Released; Package: 0201; Supplier 1: Digi-Key; ComponentLink1URL: https://www.bourns.com/docs/product-datasheets/crxxxxa.pdf; Supplier Part Number 1: 118-CR0201AFW-1001GLFCT-ND
R97 R98 = 3: RES, 0, JUMPER, 1/16W, 0402; MFG: YAGEO; MFG P/N: RC0402FR-070RL; COMMON: 470-02332-00; Status: NRND; Package: 0402; Value: 0; Supplier 1: Digi-Key; ComponentLink1URL: https://www.digikey.com/en/products/detail/yageo/RC0402FR-070RL/2827570; Supplier Part Number 1: 311-0.0LRCT-ND
  R98: DNI: DNI
R109 = 10014: RES, 68, 1%, 1/20W, 0201, AUTOGRADE; MFG: Panasonic Electronic Components; MFG P/N: ERJ-1GNF68R0C; Status: Released; Package: 0201; Supplier 1: Digi-Key; ComponentLink1URL: https://industrial.panasonic.com/cdbs/www-data/pdf/RDA0000/AOA0000C304.pdf; Supplier Part Number 1: P123132CT-ND
SW1-SW3 = SW_2P-KSR253GLFG: SWITCH TACTILE SPST-NO 0.01A 32V; MFG: C&K; ComponentLink1URL: https://www.digikey.com/en/products/detail/c-k/KSR253GLFG/958074?s=N4IgTCBcDaINIGUBKYCsBmA4gGQGKZAF0BfIA; MFG P/N: KSR253GLFG; Supplier 1: Digi-Key; Supplier Part Number 1: 401-1708-1-ND; Value: KSR253GLFG
U6 = 112: IC, MCU, STM32H755xI, ARM, 32-BIT, 240MHZ, 128 I/O, 2MB, FLASH, 1.62V TO 3.6V, UFBGA-201; MFG: STMicroelectronics; Value: BGS201C65P15X15_1000X1000X60; Status: Released; Package: 176+25UFBGA (10x10); Supplier 1: Digi-Key; ComponentLink1URL: https://www.st.com/resource/en/datasheet/stm32h755ii.pdf; Supplier Part Number 1: 497-STM32H755IIK3-ND

## Sheet ProcessorSupport.SchDoc
size 420 x 297 mm; SheetNumber: 6; SheetTotal: 14; PageSetup: Record=PageOptions|CenterHorizontal=True|CenterVertical=True|PrintScale=0.96|XCorrection=1.00|YCorrection=1.00|PrintKind=1|BorderSize=5000000|LeftOffset=0|BottomOffset=0|Orientation=2|PaperLength=4318|PaperWidth=2794|Scale=100|PaperSource=7|PrintQuality=600|MediaType=1|DitherType=10|PaperKind=11" x 17"|PrintScaleMode=1
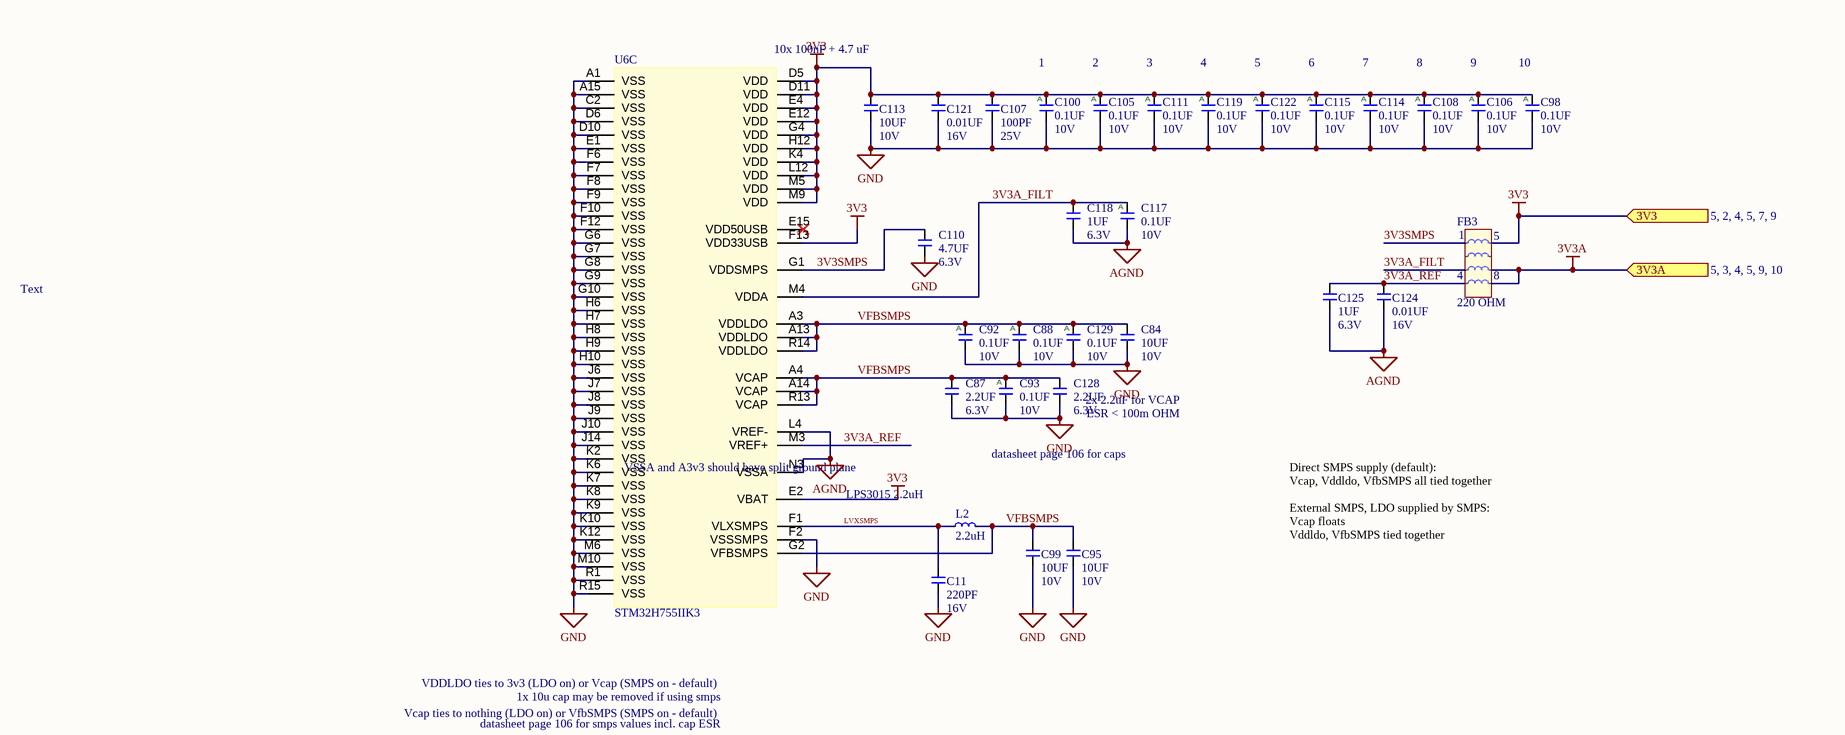
[diagram p2: ProcessorSupport.SchDoc]

### Parts
C11  value 220PF  Voltage: 16V  [C0201]  (hidden comment: __Template_Cap)
C84  value 10UF  Voltage: 10V  [C0402]  (hidden comment: __Template_Cap)
C87  value 2.2UF  Voltage: 6.3V  [C0201]  (hidden comment: __Template_Cap)
C88  value 0.1UF  Voltage: 10V  [C0201]  (hidden comment: __Template_Cap_Auto)
C92  value 0.1UF  Voltage: 10V  [C0201]  (hidden comment: __Template_Cap_Auto)
C93  value 0.1UF  Voltage: 10V  [C0201]  (hidden comment: __Template_Cap_Auto)
C95  value 10UF  Voltage: 10V  [C0402]  (hidden comment: __Template_Cap)
C98  value 0.1UF  Voltage: 10V  [C0201]  (hidden comment: __Template_Cap_Auto)
C99  value 10UF  Voltage: 10V  [C0402]  (hidden comment: __Template_Cap)
C100  value 0.1UF  Voltage: 10V  [C0201]  (hidden comment: __Template_Cap_Auto)
C105  value 0.1UF  Voltage: 10V  [C0201]  (hidden comment: __Template_Cap_Auto)
C106  value 0.1UF  Voltage: 10V  [C0201]  (hidden comment: __Template_Cap_Auto)
C107  value 100PF  Voltage: 25V  [C0201]  (hidden comment: __Template_Cap)
C108  value 0.1UF  Voltage: 10V  [C0201]  (hidden comment: __Template_Cap_Auto)
C110  value 4.7UF  Voltage: 6.3V  [C0402]  (hidden comment: __Template_Cap)
C111  value 0.1UF  Voltage: 10V  [C0201]  (hidden comment: __Template_Cap_Auto)
C113  value 10UF  Voltage: 10V  [C0402]  (hidden comment: __Template_Cap)
C114  value 0.1UF  Voltage: 10V  [C0201]  (hidden comment: __Template_Cap_Auto)
C115  value 0.1UF  Voltage: 10V  [C0201]  (hidden comment: __Template_Cap_Auto)
C117  value 0.1UF  Voltage: 10V  [C0201]  (hidden comment: __Template_Cap_Auto)
C118  value 1UF  Voltage: 6.3V  [C0201]  (hidden comment: __Template_Cap)
C119  value 0.1UF  Voltage: 10V  [C0201]  (hidden comment: __Template_Cap_Auto)
C121  value 0.01UF  Voltage: 16V  [C0201]  (hidden comment: __Template_Cap)
C122  value 0.1UF  Voltage: 10V  [C0201]  (hidden comment: __Template_Cap_Auto)
C124  value 0.01UF  Voltage: 16V  [C0201]  (hidden comment: __Template_Cap)
C125  value 1UF  Voltage: 6.3V  [C0201]  (hidden comment: __Template_Cap)
C128  value 2.2UF  Voltage: 6.3V  [C0201]  (hidden comment: __Template_Cap)
C129  value 0.1UF  Voltage: 10V  [C0201]  (hidden comment: __Template_Cap_Auto)
FB3  value 220 OHM  [FB_ARRAY_BLA31AG221SN4D]  (hidden comment: FB_ARRAY_BLA31AG221SN4D)
L2  value 2.2uH  [IND_LPS3015-152MRB]  (hidden comment: __Template_Inductor)
U6  MFG P/N: STM32H755IIK3  [BGS201C65P15X15_1000X1000X60]  (hidden comment: MCU_STM32H755IIK3)  (part C of 3)

### Ports
3V3 (in, see 5, 2, 4, 5, 7, 9), 3V3A (in, see 5, 3, 4, 5, 9, 10)

### Nets
3V3: C98.1 C100.1 C105.1 C106.1 C107.1 C108.1 C111.1 C113.1 C114.1 C115.1 C119.1 C121.1 C122.1 FB3.5 U6.D5(VDD) U6.D11(VDD) U6.E2(VBAT) U6.E4(VDD) U6.E12(VDD) U6.F13(VDD33USB) U6.G4(VDD) U6.H12(VDD) U6.K4(VDD) U6.L12(VDD) U6.M5(VDD) U6.M9(VDD) ; port 3V3
3V3A: FB3.7 FB3.8 ; port 3V3A
AGND: C117.2 C118.2 C124.2 C125.2 U6.L4(VREF-) U6.N3(VSSA)
GND: C11.2 C84.2 C87.2 C88.2 C92.2 C93.2 C95.1 C98.2 C99.1 C100.2 C105.2 C106.2 C107.2 C108.2 C110.2 C111.2 C113.2 C114.2 C115.2 C119.2 C121.2 C122.2 C128.2 C129.2 U6.A1(VSS) U6.A15(VSS) U6.C2(VSS) U6.D6(VSS) U6.D10(VSS) U6.E1(VSS) U6.F2(VSSSMPS) U6.F6(VSS) U6.F7(VSS) U6.F8(VSS) U6.F9(VSS) U6.F10(VSS) U6.F12(VSS) U6.G6(VSS) U6.G7(VSS) U6.G8(VSS) U6.G9(VSS) U6.G10(VSS) U6.H6(VSS) U6.H7(VSS) U6.H8(VSS) U6.H9(VSS) U6.H10(VSS) U6.J6(VSS) U6.J7(VSS) U6.J8(VSS) U6.J9(VSS) U6.J10(VSS) U6.J14(VSS) U6.K2(VSS) U6.K6(VSS) U6.K7(VSS) U6.K8(VSS) U6.K9(VSS) U6.K10(VSS) U6.K12(VSS) U6.M6(VSS) U6.M10(VSS) U6.R1(VSS) U6.R15(VSS)
3V3A_FILT: C117.1 C118.1 FB3.3 U6.M4(VDDA)
3V3A_REF: C124.1 C125.1 FB3.4 U6.M3(VREF+)
3V3SMPS: C110.1 FB3.1 U6.G1(VDDSMPS)
LVXSMPS: C11.1 L2.1 U6.F1(VLXSMPS)
VFBSMPS: C84.1 C87.1 C88.1 C92.1 C93.1 C95.2 C99.2 C128.1 C129.1 L2.2 U6.A3(VDDLDO) U6.A4(VCAP) U6.A13(VDDLDO) U6.A14(VCAP) U6.G2(VFBSMPS) U6.R13(VCAP) U6.R14(VDDLDO)

Not connected (* = marked no-connect by the designer): FB3 2 6; U6 E15(VDD50USB)*

### Notes on the sheet
- 10x 100nF + 4.7 uF
- (near C100) 1
- (near C105) 2
- (near C111) 3
- (near C119) 4
- (near C122) 5
- (near C115) 6
- (near C114) 7
- (near C108) 8
- (near C106) 9
- (near C98) 10
- Text
- 2x 2.2uF for VCAP
- VSSA and A3v3 should have split ground plane
- datasheet page 106 for caps
- ESR < 100m OHM
- (near L2) LPS3015 2.2uH
- Direct SMPS supply (default):
  Vcap, Vddldo, VfbSMPS all tied together
  External SMPS, LDO supplied by SMPS:
  Vcap floats
  Vddldo, VfbSMPS tied together
- VDDLDO ties to 3v3 (LDO on) or Vcap (SMPS on - default)
- Vcap ties to nothing (LDO on) or VfbSMPS (SMPS on - default)
- 1x 10u cap may be removed if using smps
- datasheet page 106 for smps values incl. cap ESR
- CREATIVE COMMONS
- PUBLIC LICENSE:
- BARKOUR ROBOT
- CC BY-NC 4.0
- APPROVED
- DWG NO
- GOOGLE LLC
- FILE
- RELEASED
- 2024/05/09
- SIZE
- 1600 AMPHITHEATRE PARKWAY
- MOUNTAIN VIEW CA 94043
- A3
- SHEET
- OF
- THIS DESIGN IS BEING PROVIDED  FOR NON-COMMERCIAL USE ONLY. THE USE OF =SCIENTIST_NAME_POSSESSIVE NAME IN CONNECTION WITH THE DESIGN IS NOT INTENDED TO IMPLY THAT =SCIENTIST_NAME SPONSORS OR ENDORSES THE DESIGN, GOOGLE LLC, OR ANY OF GOOGLE LLC'S PRODUCTS OR SERVICES.
- (in symbol 934) A

### Library data of the parts
C11 = 156: CAP, CER, X7R, 220pF, 16V, 10%, 0201, 0.33mm T; MFG: MURATA; MFG P/N: GRM033R71C221KA01D; COMMON: 150-00794-00; Status: Released; Package: 0201; Supplier 1: Digi-Key; ComponentLink1URL: https://www.digikey.com/en/products/detail/murata-electronics/GRM033R71C221KA01D/2543508; Supplier Part Number 1: 490-6149-1-ND
C84 C95 C99 C113 = 215: CAP, CER, X5R, 10uF, 10V, 20%, 0402, 0.7mm T; MFG: SAMSUNG; MFG P/N: CL05A106MP5NUNC; COMMON: 150-00376-00; Status: Released; Package: 0402; Supplier 1: Digi-Key; ComponentLink1URL: https://www.digikey.com/en/products/detail/samsung-electro-mechanics/CL05A106MP5NUNC/3887108; Supplier Part Number 1: 1276-1450-1-ND
C87 C128 = 110: CAP, CER, X5R, 2.2uF, 6.3V, 20%, 0201, 0.39mm T; MFG: SAMSUNG; MFG P/N: CL03A225MQ3CRNC; COMMON: 150-00421-00; Status: Released; Package: 0201; Supplier 1: Digi-Key; ComponentLink1URL: https://www.digikey.com/en/products/detail/samsung-electro-mechanics/CL03A225MQ3CRNC/5961354; Supplier Part Number 1: 1276-6870-1-ND
C88 C92 C93 C98 C100 C105 C106 C108 C111 C114 C115 C117 C119 C122 C129 = 934: as C51 on sheet Processor; Status: Released; Package: 0201; Supplier 1: Digi-key; ComponentLink1URL: https://search.murata.co.jp/Ceramy/image/img/A01X/G101/ENG/GRT033C81A104KE01-01.pdf; Supplier Part Number 1: 490-12232-1-ND
C107 = 767: as C131 on sheet Processor; Status: Released; Package: 0201; Supplier 1: Digi-Key; ComponentLink1URL: https://www.digikey.com/en/products/detail/murata-electronics/GRM033R71E101KA01D/702438; Supplier Part Number 1: 490-3172-1-ND
C110 = 50: CAP, CER, X5R, 4.7uF, 20%, 6.3V, 0402, 0.65mm; MFG: TDK; MFG P/N: C1005X5R0J475M050BC; COMMON: 150-00023-00; Status: Released; Package: 0402; Supplier 1: Digi-Key; ComponentLink1URL: https://www.digikey.com/en/products/detail/tdk-corporation/C1005X5R0J475M050BC/2732830; Supplier Part Number 1: 445-7395-1-ND
C118 C125 = 240: CAP, CER, X5R, 1uF, 6.3V, 20%, 0201, 0.33mm T; MFG: SAMSUNG; MFG P/N: CL03A105MQ3CSNC; COMMON: 150-00980-00; Status: Released; Package: 0201; Supplier 1: Digi-Key; ComponentLink1URL: https://www.digikey.com/en/products/detail/samsung-electro-mechanics/CL03A105MQ3CSNC/3886983; Supplier Part Number 1: 1276-1325-1-ND
C121 C124 = 361: CAP, CER, X5R, 0.01uF, 16V, 10%, 0201, 0.33mm T; MFG: MURATA; MFG P/N: GRM033R61C103KA12D; COMMON: 150-00126-00; Status: Released; Package: 0201; Supplier 1: Digi-Key; ComponentLink1URL: https://www.digikey.com/en/products/detail/murata-electronics/GRM033R61C103KA12D/4213197; Supplier Part Number 1: 490-7223-1-ND
FB3 = 937: FERRITE, BEAD, 220 OHM, 150mA, DCR 0.25 MAX, 1206; MFG: Murata Electronics; Status: Released; MFG P/N: BLA31AG221SN4D; Package: 1206-Array; Supplier 1: Digi-Key; ComponentLink1URL: https://www.murata.com/en-us/products/productdata/8796743204894/ENFA0008.pdf; Supplier Part Number 1: 490-9700-1-ND
L2 = 939: IND, WIREWOUND, SHIELDED, 2.2uH, 2.1A, 20%, DCR 0.11, SMD, AUTOGRADE; MFG: COILCRAFT; MFG P/N: LPS3015-222MR_; Status: Released; Package: 2 - pin SMD; Supplier 1: Digi-Key; ComponentLink1URL: https://www.coilcraft.com/getmedia/5d262731-85ef-4348-8ab4-1044b4fc3cb8/lps3015.pdf; Supplier Part Number 1: 2457-LPS3015-222MR_TR-ND
U6 = 112: as U6 on sheet Processor; Status: Released; Package: 176+25UFBGA (10x10); Supplier 1: Digi-Key; ComponentLink1URL: https://www.st.com/resource/en/datasheet/stm32h755ii.pdf; Supplier Part Number 1: 497-STM32H755IIK3-ND

## Sheet Accelerometer.SchDoc
size 420 x 297 mm; SheetNumber: 2; SheetTotal: 14; PageSetup: Record=PageOptions|CenterHorizontal=True|CenterVertical=True|PrintScale=0.96|XCorrection=1.00|YCorrection=1.00|PrintKind=1|BorderSize=5000000|LeftOffset=0|BottomOffset=0|Orientation=2|PaperLength=4318|PaperWidth=2794|Scale=100|PaperSource=7|PrintQuality=600|MediaType=1|DitherType=10|PaperKind=11" x 17"|PrintScaleMode=1
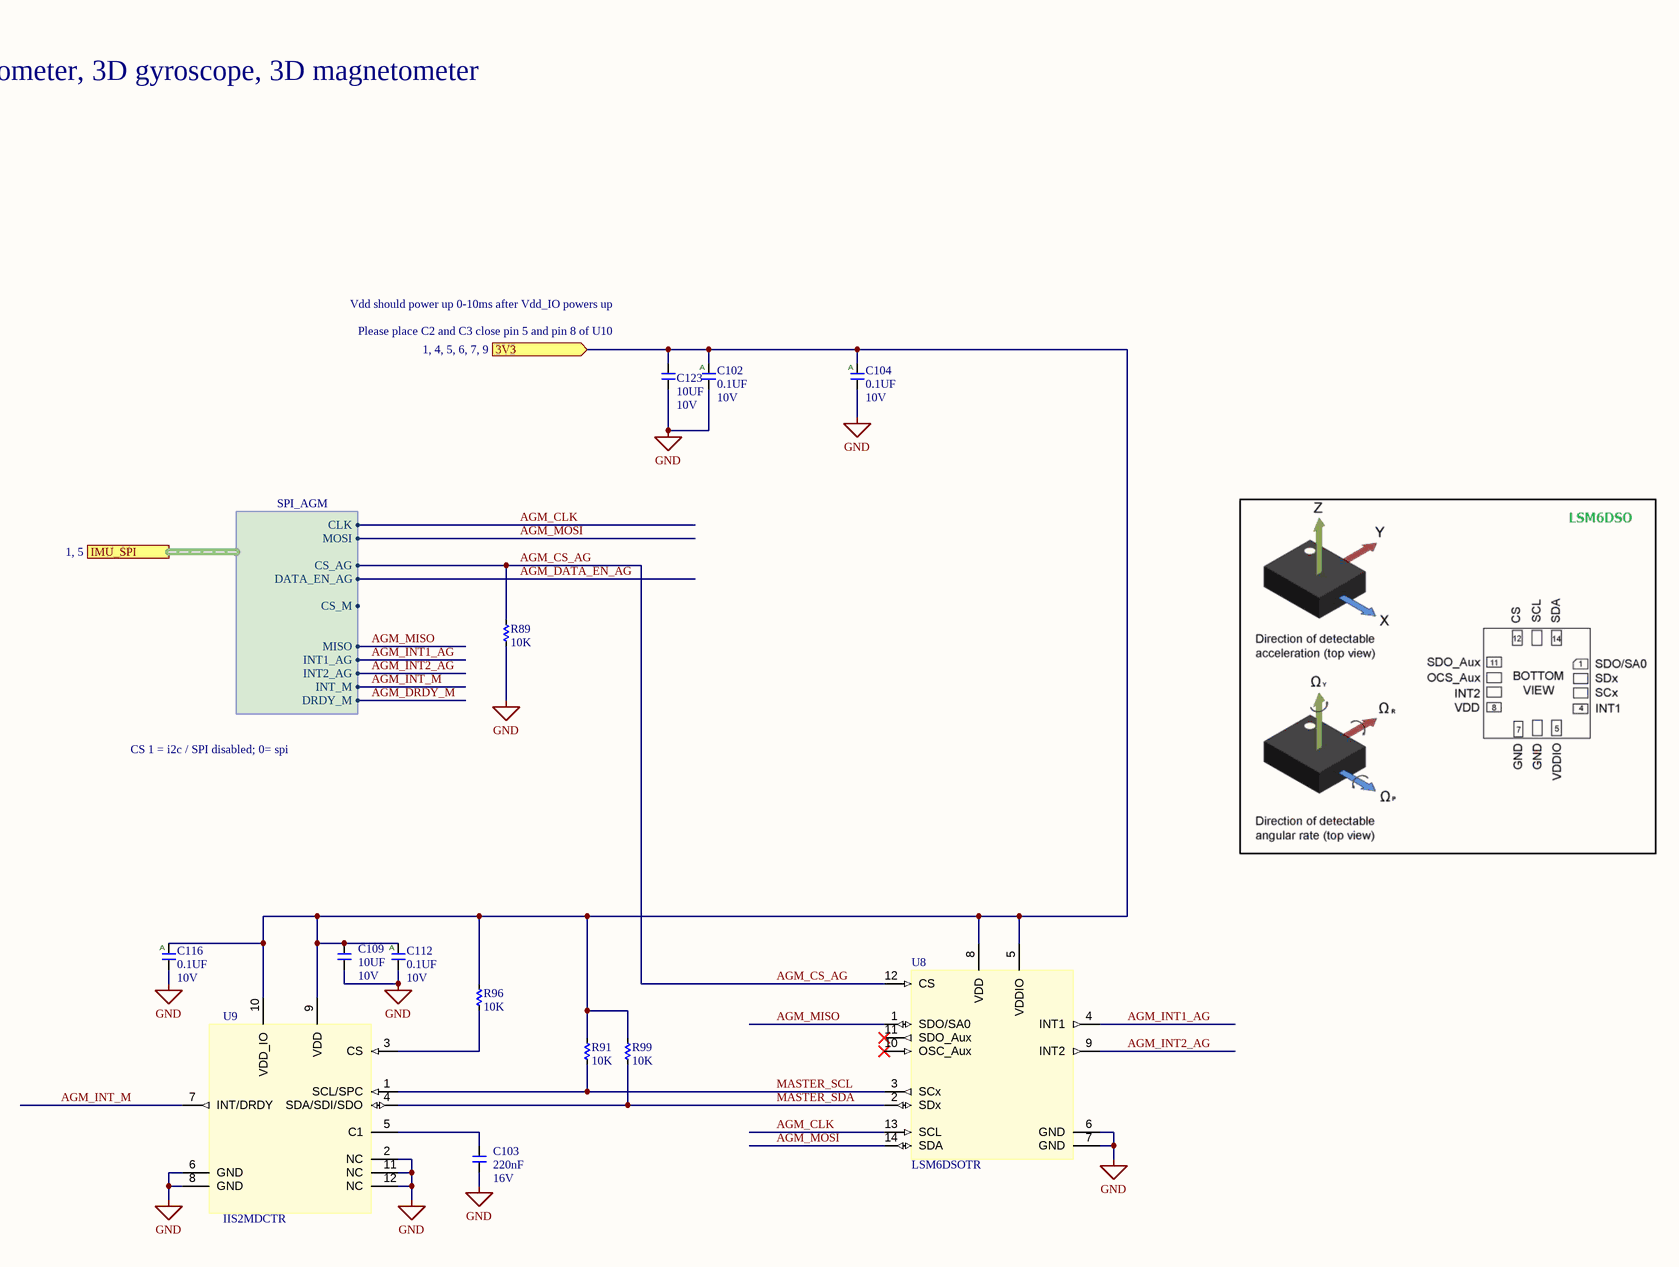
[diagram p3: Accelerometer.SchDoc]

### Parts
C102  value 0.1UF  Voltage: 10V  [C0201]  (hidden comment: __Template_Cap_Auto)
C103  value 220nF  Voltage: 16V  [C0402]  (hidden comment: __Template_Cap)
C104  value 0.1UF  Voltage: 10V  [C0201]  (hidden comment: __Template_Cap_Auto)
C109  value 10UF  Voltage: 10V  [C0402]  (hidden comment: __Template_Cap)
C112  value 0.1UF  Voltage: 10V  [C0201]  (hidden comment: __Template_Cap_Auto)
C116  value 0.1UF  Voltage: 10V  [C0201]  (hidden comment: __Template_Cap_Auto)
C123  value 10UF  Voltage: 10V  [C0402]  (hidden comment: __Template_Cap)
R89  value 10K  [R0201]  (hidden comment: __Template_Resistor)
R91  value 10K  [R0201]  (hidden comment: __Template_Resistor)
R96  value 10K  [R0201]  (hidden comment: __Template_Resistor)
R99  value 10K  [R0201]  (hidden comment: __Template_Resistor)
U8  SENSOR_ST_LSM6DSOTR  [14-LGA]  (value not drawn)
U9  SENSOR_ST_IIS2MDCTR  [12-LGA]  (value not drawn)

### Ports
3V3 (in, see 1, 4, 5, 6, 7, 9), IMU_SPI (harness SPI_AGM, see 1, 5)

### Harnesses
SPI_AGM: CLK, CS_AG, MOSI, MISO, CS_M, DATA_EN_AG, INT1_AG, INT2_AG, INT_M, DRDY_M

### Nets
3V3: C102.1 C104.1 C109.1 C112.1 C116.1 C123.1 R91.2 R96.2 R99.2 U8.5(VDDIO) U8.8(VDD) U9.9(VDD) U9.10(VDD_IO) ; port 3V3
GND: C102.2 C103.2 C104.2 C109.2 C112.2 C116.2 C123.2 R89.1 U8.6(GND) U8.7(GND) U9.2(NC) U9.6(GND) U9.8(GND) U9.11(NC) U9.12(NC)
AGM_CLK: U8.13(SCL) ; port IMU_SPI.CLK
AGM_CS_AG: R89.2 U8.12(CS) ; port IMU_SPI.CS_AG
AGM_INT1_AG: U8.4(INT1) ; port IMU_SPI.INT1_AG
AGM_INT2_AG: U8.9(INT2) ; port IMU_SPI.INT2_AG
AGM_INT_M: U9.7(INT/DRDY) ; port IMU_SPI.INT_M
AGM_MISO: U8.1(SDO/SA0) ; port IMU_SPI.MISO
AGM_MOSI: U8.14(SDA) ; port IMU_SPI.MOSI
MASTER_SCL: R91.1 U8.3(SCx) U9.1(SCL/SPC)
MASTER_SDA: R99.1 U8.2(SDx) U9.4(SDA/SDI/SDO)
NetC103_1: C103.1 U9.5(C1)
NetR96_1: R96.1 U9.3(CS)

Not connected (* = marked no-connect by the designer): U8 10(OSC_Aux)* 11(SDO_Aux)*

### Notes on the sheet
- 3D accelerometer, 3D gyroscope, 3D magnetometer
- Vdd should power up 0-10ms after Vdd_IO powers up
- Please place C2 and C3 close pin 5 and pin 8 of U10
- CS 1 = i2c / SPI disabled; 0= spi
- CREATIVE COMMONS
- PUBLIC LICENSE:
- BARKOUR ROBOT
- CC BY-NC 4.0
- APPROVED
- DWG NO
- GOOGLE LLC
- FILE
- RELEASED
- 2024/05/09
- SIZE
- 1600 AMPHITHEATRE PARKWAY
- MOUNTAIN VIEW CA 94043
- A3
- SHEET
- OF
- THIS DESIGN IS BEING PROVIDED  FOR NON-COMMERCIAL USE ONLY. THE USE OF =SCIENTIST_NAME_POSSESSIVE NAME IN CONNECTION WITH THE DESIGN IS NOT INTENDED TO IMPLY THAT =SCIENTIST_NAME SPONSORS OR ENDORSES THE DESIGN, GOOGLE LLC, OR ANY OF GOOGLE LLC'S PRODUCTS OR SERVICES.
- (in symbol 934) A

### Library data of the parts
C102 C104 C112 C116 = 934: as C51 on sheet Processor; Status: Released; Package: 0201; Supplier 1: Digi-key; ComponentLink1URL: https://search.murata.co.jp/Ceramy/image/img/A01X/G101/ENG/GRT033C81A104KE01-01.pdf; Supplier Part Number 1: 490-12232-1-ND
C103 = 1238: CAP CER 0402 220NF 16VDC X7R; MFG: KEMET; MFG P/N: C0402C224M4RAC7867; Status: Released; Package: 0402; Supplier 1: Digi-Key; ComponentLink1URL: https://www.digikey.com/en/products/detail/murata-electronics/GRM033R61C103KA12D/4213197; Supplier Part Number 1: 399-C0402C224M4RAC7867CT-ND
C109 C123 = 215: as C84 on sheet ProcessorSupport; Status: Released; Package: 0402; Supplier 1: Digi-Key; ComponentLink1URL: https://www.digikey.com/en/products/detail/samsung-electro-mechanics/CL05A106MP5NUNC/3887108; Supplier Part Number 1: 1276-1450-1-ND
R89 R91 R96 R99 = 6783: as R5 on sheet Processor; Status: Released; Package: 0201; Supplier 1: Digi-Key; ComponentLink1URL: https://industrial.panasonic.com/cdbs/www-data/pdf/RDA0000/AOA0000C304.pdf; Supplier Part Number 1: P122414CT-ND
U8 = LSM6DSOTR: Accelerometer, Gyroscope, 6 Axis Sensor I²C, SPI Output; Mfg: STMicroelectronics; Status: Released; Package: 14-LGA; Supplier 1: Digi-Key; ComponentLink1URL: https://www.st.com/content/ccc/resource/technical/document/datasheet/1e/3f/2a/d6/25/eb/48/46/DM00103319.pdf/files/DM00103319.pdf/jcr:content/translations/en.DM00103319.pdf; Supplier Part Number 1: 497-18181-1-ND; Mfg P/N: LSM6DSOTR; Value: LSM6DSOTR
U9 = IIS2MDCTR: SENSOR MR I2C/SPI 12LGA; Mfg: STMicroelectronics; Status: Released; Package: 12-LGA; Supplier 1: Digi-Key; ComponentLink1URL: https://www.st.com/content/ccc/resource/technical/document/datasheet/1e/3f/2a/d6/25/eb/48/46/DM00103319.pdf/files/DM00103319.pdf/jcr:content/translations/en.DM00103319.pdf; Supplier Part Number 1: 497-17728-1-ND; Value: IIS2MDCTR; Mfg P/N: IIS2MDCTR